# Altium project TIDA-01485.PrjPcb (part 1 of 2)
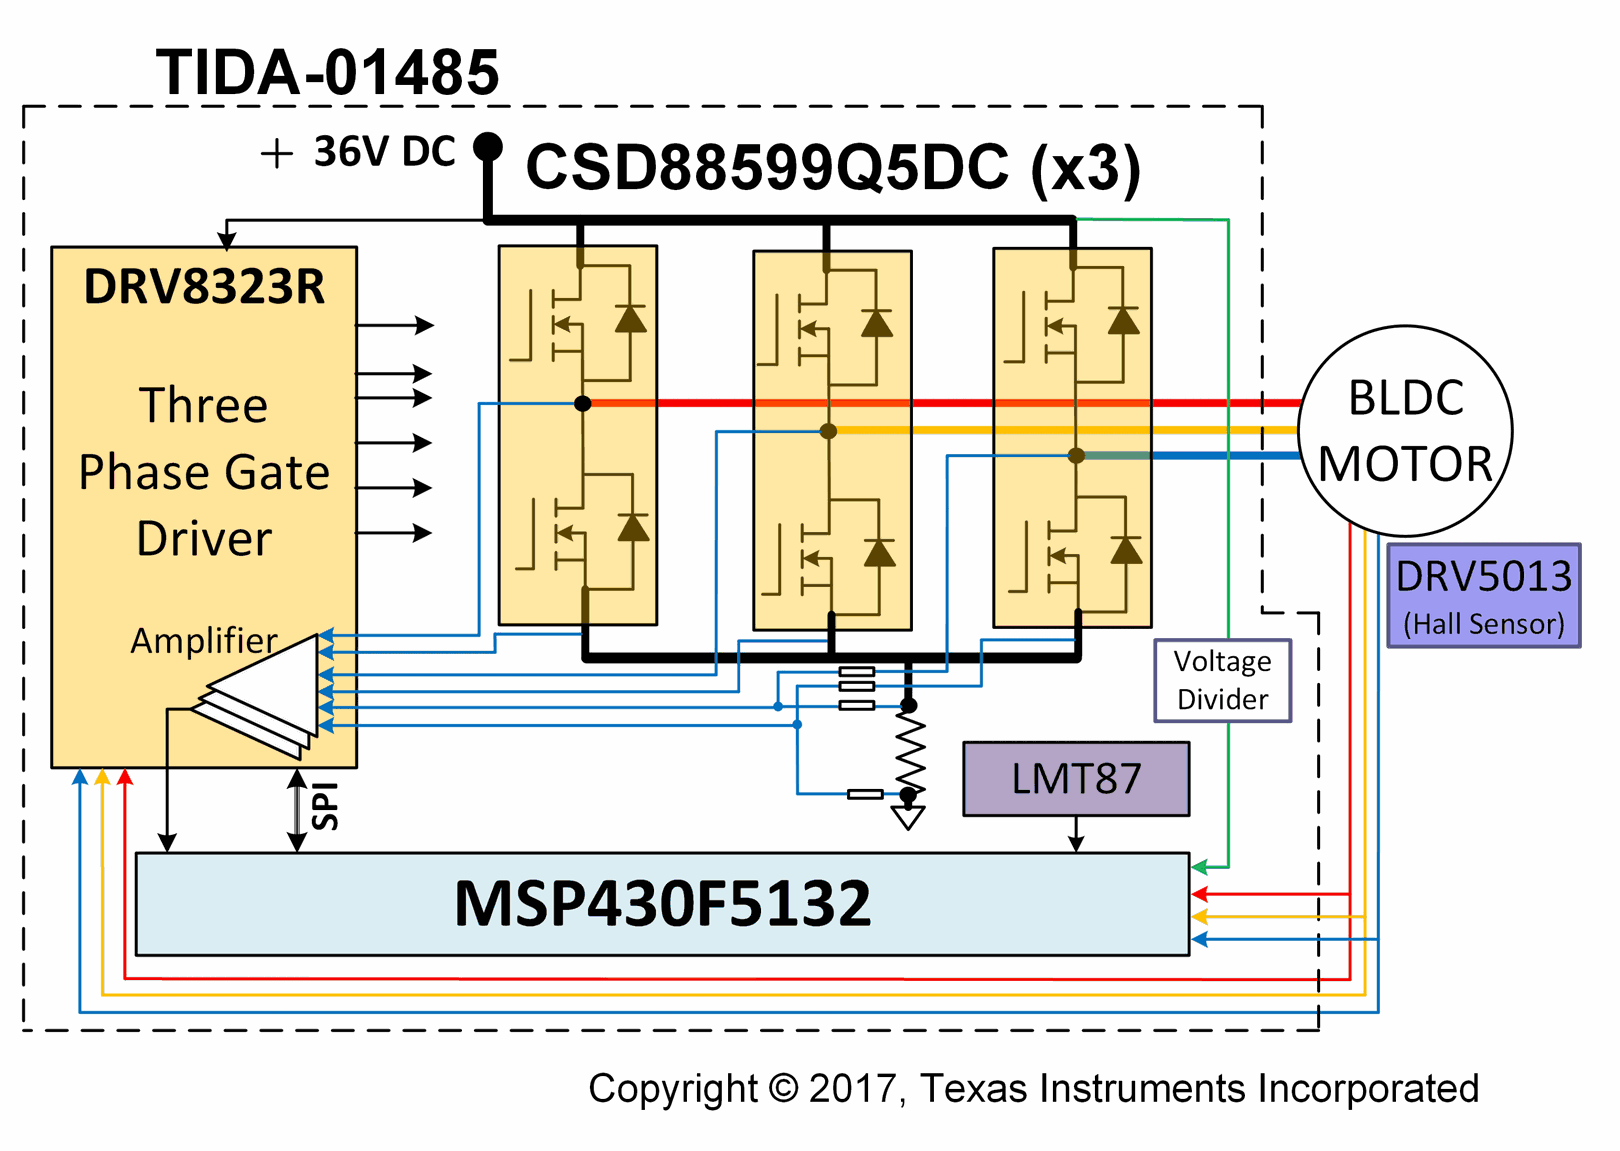
[diagram p0: TIDA-01485_CoverSheet.SchDoc]
CopyrightYear: 2017; EVM_orderable: N/A; PCB_Layout: Avinash N; PCB_Rev: E2; PRJ_Customer: Public Release; PRJ_Engineer: Manu Balakrishnan; PRJ_Number: TIDA-01485; PRJ_Title: 18V/1kW,  power stage for brushless motor; SCH_Rev: E2; TechSupport: http://www.ti.com/support; TID: 01485
5 sheets, 111 parts. Net scope: flat (ports and power ports of the same name join across sheets).
Board file: TIDA-01485.PcbDoc
Sheets:
  TIDA-01485_CoverSheet.SchDoc
  TIDA-01485_Page1.SchDoc
  TIDA-01485_Page2.SchDoc
  TIDA-01485_Page3.SchDoc
  TIDA-01485_Hardware.SchDoc

## Sheet TIDA-01485_CoverSheet.SchDoc
size 431 x 279 mm; Date: Not shown in title block; ApprovedBy: Not shown in title block; CheckedBy: Not shown in title block; Author: Not shown in title block; CompanyName: Not shown in title block; DrawnBy: Manu; Engineer: Not shown in title block; Organization: Not shown in title block; Address1: Not shown in title block; Address2: Not shown in title block; Address3: Not shown in title block; Address4: Not shown in title block; DocumentNumber: 1; Revision: Use project parameter SCH_Rev; SheetNumber: 1; SheetTotal: 5; PageSetup: Record=PageOptions|CenterHorizontal=True|CenterVertical=True|PrintScale=1.00|XCorrection=1.00|YCorrection=1.00|PrintKind=0|BorderSize=5000000|LeftOffset=0|BottomOffset=0|Orientation=2|PaperLength=1000|PaperWidth=1000|Scale=100|PaperSource=15|PrintQuality=600|MediaType=1|DitherType=10|PaperKind=Letter|PrintScaleMode=1; CurrentTime: Not shown in title block; CurrentDate: Not shown in title block; Time: Not shown in title block; DocumentFullPathAndName: Not shown in title block; DocumentName: Not shown in title block; ModifiedDate: Not shown in title block; ImagePath: Not shown in title block

### Notes on the sheet
- Drawn By:
- SVN Rev:
- Number:
- TID #:
- Orderable:
- Rev:
- Sheet Title:
- File:
- Project Title:
- Designed for:
- Assembly Variant:
- Mod. Date:
- Sheet:
- Size:
- of
- B
- http://www.ti.com
- Texas Instruments and/or its licensors do not warrant the accuracy or completeness of this specification or any information contained therein. Texas Instruments and/or its licensors do not warrant that this design will meet the specifications, will be suitable for your application or fit for any particular purpose, or will operate in an implementation. Texas Instruments and/or its licensors do not warrant that the design is production worthy. You should completely validate and test your design implementation to confirm the system functionality for your application.
- Engineer:
- Contact:
- © Texas Instruments

## Sheet TIDA-01485_Page1.SchDoc
size 431 x 279 mm; Date: Not shown in title block; ApprovedBy: Not shown in title block; CheckedBy: Not shown in title block; Author: Not shown in title block; CompanyName: Not shown in title block; DrawnBy: Manu; Engineer: Not shown in title block; Organization: Not shown in title block; Address1: Not shown in title block; Address2: Not shown in title block; Address3: Not shown in title block; Address4: Not shown in title block; DocumentNumber: 1; Revision: Use project parameter SCH_Rev; SheetNumber: 2; SheetTotal: 5; PageSetup: Record=PageOptions|CenterHorizontal=True|CenterVertical=True|PrintScale=1.00|XCorrection=1.00|YCorrection=1.00|PrintKind=0|BorderSize=5000000|LeftOffset=0|BottomOffset=0|Orientation=2|PaperLength=1000|PaperWidth=1000|Scale=100|PaperSource=15|PrintQuality=600|MediaType=1|DitherType=10|PaperKind=Letter|PrintScaleMode=1; CurrentTime: Not shown in title block; CurrentDate: Not shown in title block; Time: Not shown in title block; DocumentFullPathAndName: Not shown in title block; DocumentName: Not shown in title block; ModifiedDate: Not shown in title block; ImagePath: Not shown in title block
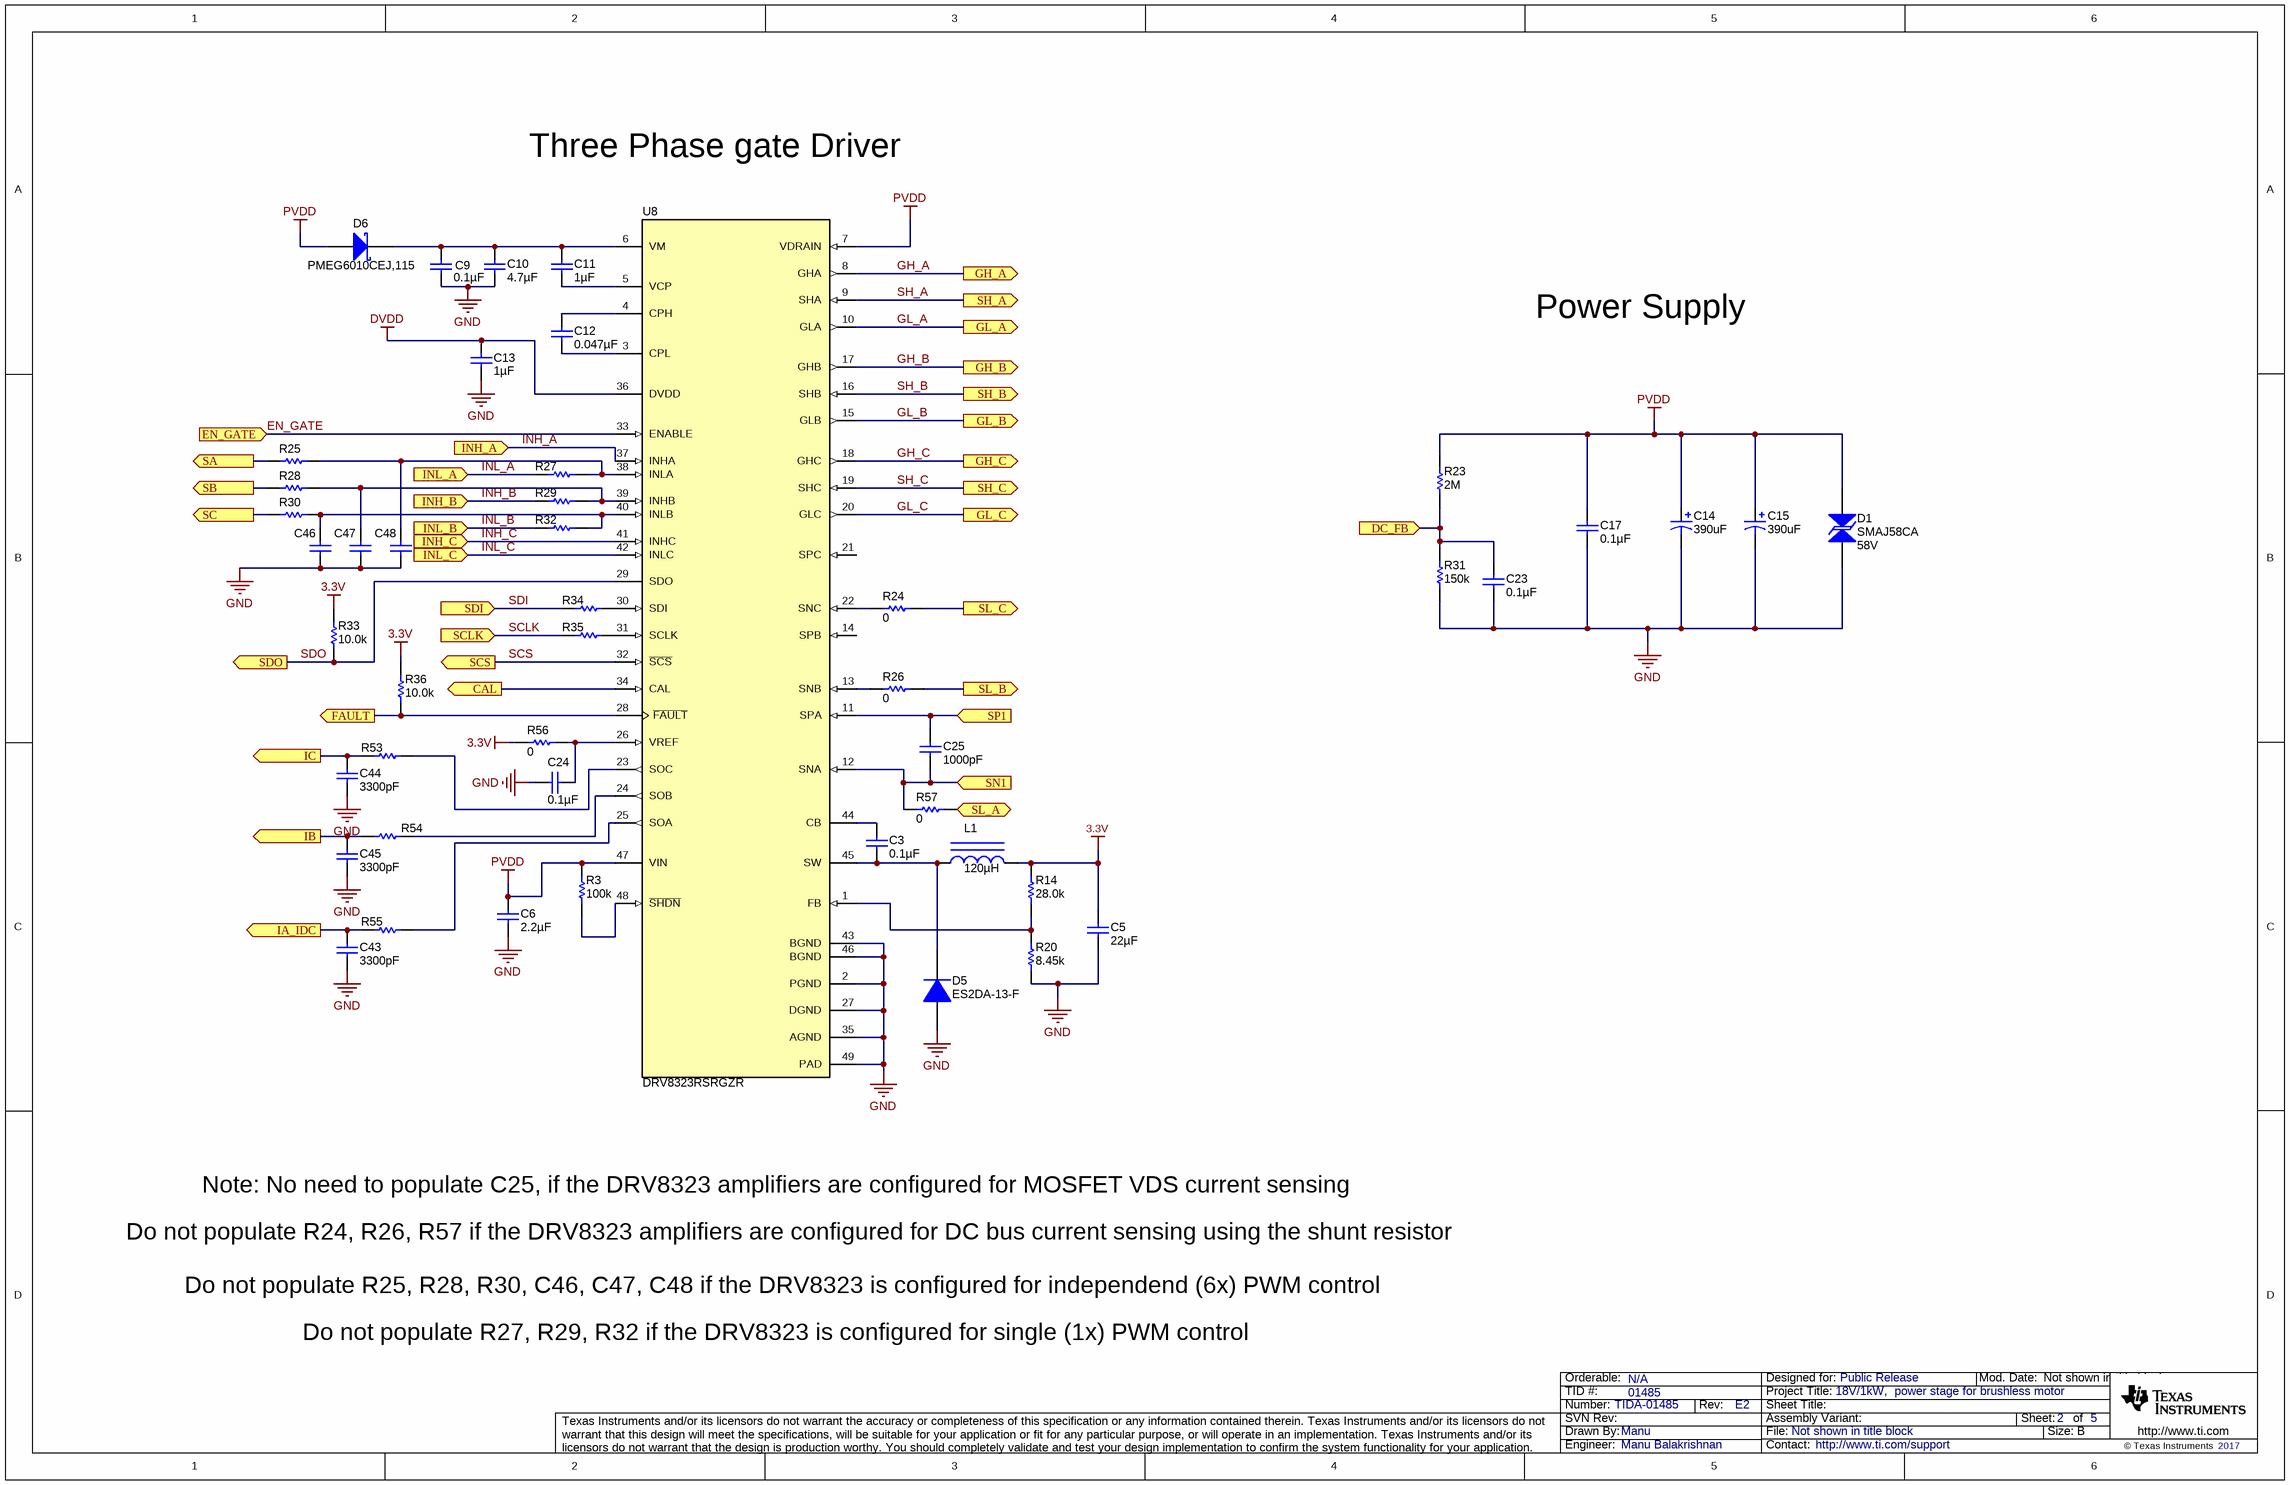
[diagram p1: TIDA-01485_Page1.SchDoc]

### Parts
C3  ValueDisplayed: 0.1µF  [0402]  (hidden comment: GRM155R71E103KA01D)
C5  ValueDisplayed: 22µF  [1210_280]  (hidden comment: C3225X7R1C226K250AC)
C6  ValueDisplayed: 2.2µF  [1210]  (hidden comment: GRM32ER72A225KA35L)
C9  ValueDisplayed: 0.1µF  [0603]  (hidden comment: 06035C104KAT2A)
C10  ValueDisplayed: 4.7µF  [0805_HV]  (hidden comment: GRM21BC71H475KE11K)
C11  ValueDisplayed: 1µF  [0603]  (hidden comment: C1608X7R1C105K)
C12  ValueDisplayed: 0.047µF  [0603]  (hidden comment: C1608X7S2A473K080AB)
C13  ValueDisplayed: 1µF  [0603]  (hidden comment: C1608X7R1C105K)
C14  ValueDisplayed: 390uF  [CAPPR5-10X20]  (hidden comment: 35ZLG470MEFC10X20)
C15  ValueDisplayed: 390uF  [CAPPR5-10X20]  (hidden comment: 35ZLG470MEFC10X20)
C17  ValueDisplayed: 0.1µF  [1206_180]  (hidden comment: C3216X7R2A104K160AA)
C23  ValueDisplayed: 0.1µF  [0402]  (hidden comment: 885012105016)
C24  ValueDisplayed: 0.1µF  [0402]  (hidden comment: 885012105016)
C25  ValueDisplayed: 1000pF  [0402]  (hidden comment: 885012205061)
C43  ValueDisplayed: 3300pF  [0402]  (hidden comment: CGA2B2X7R1H332K050BA)
C44  ValueDisplayed: 3300pF  [0402]  (hidden comment: CGA2B2X7R1H332K050BA)
C45  ValueDisplayed: 3300pF  [0402]  (hidden comment: CGA2B2X7R1H332K050BA)
C46  885012205061  [0402]  (value not drawn)
C47  885012205061  [0402]  (value not drawn)
C48  885012205061  [0402]  (value not drawn)
D1  SMAJ58CA  value 58V  [SMA]
D5  ES2DA-13-F  [SMA]
D6  PMEG6010CEJ,115  [SOD-323F]
L1  ValueDisplayed: 120µH  [SDR0302]  (hidden comment: SDR0302-121KL)
R3  ValueDisplayed: 100k  [0402]  (hidden comment: ERJ-2GEJ104X)
R14  ValueDisplayed: 28.0k  [0402]  (hidden comment: CRCW040230K9FKED)
R20  ValueDisplayed: 8.45k  [0402]  (hidden comment: CRCW040210K0FKED)
R23  ValueDisplayed: 2M  [0603]  (hidden comment: RC0603FR-0734K8L)
R24  ValueDisplayed: 0  [0402]  (hidden comment: RC0402JR-070RL)
R25  ERJ-2RKF1000X  [0402]  (value not drawn)
R26  ValueDisplayed: 0  [0402]  (hidden comment: RC0402JR-070RL)
R27  ERJ-2RKF1000X  [0402]  (value not drawn)
R28  ERJ-2RKF1000X  [0402]  (value not drawn)
R29  ERJ-2RKF1000X  [0402]  (value not drawn)
R30  ERJ-2RKF1000X  [0402]  (value not drawn)
R31  ValueDisplayed: 150k  [0402]  (hidden comment: ERJ-2RKF2201X)
R32  ERJ-2RKF1000X  [0402]  (value not drawn)
R33  ValueDisplayed: 10.0k  [0402]  (hidden comment: CRCW040210K0FKED)
R34  ERJ-2RKF1000X  [0402]  (value not drawn)
R35  ERJ-2RKF1000X  [0402]  (value not drawn)
R36  ValueDisplayed: 10.0k  [0402]  (hidden comment: CRCW040210K0FKED)
R53  ERJ-2RKF1000X  [0402]  (value not drawn)
R54  ERJ-2RKF1000X  [0402]  (value not drawn)
R55  ERJ-2RKF1000X  [0402]  (value not drawn)
R56  ValueDisplayed: 0  [0402]  (hidden comment: RC0402JR-070RL)
R57  ValueDisplayed: 0  [0402]  (hidden comment: RC0402JR-070RL)
U8  DRV8323RSRGZR  [RGZ0048B]

### Ports
CAL (out), DC_FB (in), EN_GATE (in), FAULT (out), GH_A (out), GH_B (out), GH_C (out), GL_A (out), GL_B (out), GL_C (out), IA_IDC (out), IB (out), IC (out), INH_A (in), INH_B (in), INH_C (in), INL_A (in), INL_B (in), INL_C (in), SA (out), SB (out), SC (out), SCLK (in), SCS (out), SDI (in), SDO (out), SH_A (out), SH_B (out), SH_C (out), SL_A (out), SL_B (out), SL_C (out), SN1 (in), SP1 (in)

### Nets
3.3V: C5.1 L1.2 R14.2 R33.1 R36.1 R56.1
DVDD: C13.1 U8.36(DVDD)
GND: C5.2 C6.2 C9.2 C10.1 C13.2 C14.2(-) C15.2(-) C17.2 C23.2 C24.2 C43.2 C44.2 C45.2 C46.2 C47.2 C48.2 D1.1 D5.2(A) R20.1 R31.1 U8.2(PGND) U8.27(DGND) U8.35(AGND) U8.43(BGND) U8.46(BGND) U8.49(PAD)
PVDD: C6.1 C14.1(+) C15.1(+) C17.1 D1.2 D6.2(A) R3.2 R23.2 U8.7(VDRAIN) U8.47(VIN)
CAL: U8.34(CAL) ; port CAL
DC_FB: C23.1 R23.1 R31.2 ; port DC_FB
EN_GATE: U8.33(ENABLE) ; port EN_GATE
FAULT: R36.2 U8.28(~{FAULT}) ; port FAULT
GH_A: U8.8(GHA) ; port GH_A
GH_B: U8.17(GHB) ; port GH_B
GH_C: U8.18(GHC) ; port GH_C
GL_A: U8.10(GLA) ; port GL_A
GL_B: U8.15(GLB) ; port GL_B
GL_C: U8.20(GLC) ; port GL_C
IA_IDC: C43.1 R55.2 ; port IA_IDC
IB: C45.1 R54.2 ; port IB
IC: C44.1 R53.2 ; port IC
INH_A: U8.37(INHA) ; port INH_A
INH_B: R29.1 ; port INH_B
INH_C: U8.41(INHC) ; port INH_C
INL_A: R27.1 ; port INL_A
INL_B: R32.1 ; port INL_B
INL_C: U8.42(INLC) ; port INL_C
SA: R25.1 ; port SA
SB: R28.1 ; port SB
SC: R30.1 ; port SC
SCLK: R35.2 ; port SCLK
SCS: U8.32(~{SCS}) ; port SCS
SDI: R34.2 ; port SDI
SDO: R33.2 U8.29(SDO) ; port SDO
SH_A: U8.9(SHA) ; port SH_A
SH_B: U8.16(SHB) ; port SH_B
SH_C: U8.19(SHC) ; port SH_C
SL_A: R24.1 R26.1 R57.1 ; port SL_B, port SL_C, port SL_A
SN1: C25.2 R57.2 U8.12(SNA) ; port SN1
SP1: C25.1 U8.11(SPA) ; port SP1
NetC3_1: C3.1 U8.44(CB)
NetC3_2: C3.2 D5.1(K) L1.1 U8.45(SW)
NetC9_1: C9.1 C10.2 C11.1 D6.1(K) U8.6(VM)
NetC11_2: C11.2 U8.5(VCP)
NetC12_1: C12.1 U8.3(CPL)
NetC12_2: C12.2 U8.4(CPH)
NetC24_1: C24.1 R56.2 U8.26(VREF)
NetC46_1: C46.1 R30.2 R32.2 U8.40(INLB)
NetC47_1: C47.1 R28.2 R29.2 U8.39(INHB)
NetC48_1: C48.1 R25.2 R27.2 U8.38(INLA)
NetR3_1: R3.1 U8.48(~{SHDN})
NetR14_1: R14.1 R20.2 U8.1(FB)
NetR24_2: R24.2 U8.22(SNC)
NetR26_2: R26.2 U8.13(SNB)
NetR34_1: R34.1 U8.30(SDI)
NetR35_1: R35.1 U8.31(SCLK)
NetR53_1: R53.1 U8.23(SOC)
NetR54_1: R54.1 U8.24(SOB)
NetR55_1: R55.1 U8.25(SOA)

Not connected (* = marked no-connect by the designer): U8 14(SPB) 21(SPC)

### Notes on the sheet
- Three Phase gate Driver
- Power Supply
- Note: No need to populate C25, if the DRV8323 amplifiers are configured for MOSFET VDS current sensing
- Do not populate R24, R26, R57 if the DRV8323 amplifiers are configured for DC bus current sensing using the shunt resistor
- Do not populate R25, R28, R30, C46, C47, C48 if the DRV8323 is configured for independend (6x) PWM control
- Do not populate R27, R29, R32 if the DRV8323 is configured for single (1x) PWM control
- Drawn By:
- SVN Rev:
- Number:
- TID #:
- Orderable:
- Rev:
- Sheet Title:
- File:
- Project Title:
- Designed for:
- Assembly Variant:
- Mod. Date:
- Sheet:
- Size:
- of
- B
- http://www.ti.com
- Texas Instruments and/or its licensors do not warrant the accuracy or completeness of this specification or any information contained therein. Texas Instruments and/or its licensors do not warrant that this design will meet the specifications, will be suitable for your application or fit for any particular purpose, or will operate in an implementation. Texas Instruments and/or its licensors do not warrant that the design is production worthy. You should completely validate and test your design implementation to confirm the system functionality for your application.
- Engineer:
- Contact:
- © Texas Instruments

### Library data of the parts
C3 C24 = 885012105016: CAP, CERM, 0.1 µF, 16 V, +/- 20%, X5R, 0402; Manufacturer: Wurth Elektronik; Polarized: N; CompType: Capacitor; Value: 0.1uF; U/M: EA; Cap_F: 0.0000001; Tolerance_%: 20; Value1: Unknown; VDC_V: 16; Value2: 16V; TaMin_C: -55; TaMax_C: 85; SizeArea_mm2: 0.5; SizeAreaWB_mm2: 3; SizeX_mm: 1; SizeZ_mm: 0.6; AEC Category: Q200; SymbolVersion: 2008-07-09; PartNumber: 885012105016; PackageReference: 0402; RoHS: Y; MountType: SMT; Technology: Ceramic; TempCo: X5R; Cap_Case: 0402; SizeY_mm: 0.5; Published: 2008-06-19; Publisher: Texas Instruments; LatestRevisionDate: 2016-08-24; ComponentLink1Description: Datasheet link; ComponentLink1URL: http://katalog.we-online.de/pbs/datasheet/885012105016.pdf; Supplier 1: Mouser; Supplier Part Number 1: 710-885012105016; Supplier 2: Newark; Supplier Part Number 2: 40Y4445; AEC Qualified: N; AEC Grade: N/A
C5 = C3225X7R1C226K250AC: CAP, CERM, 22 µF, 16 V,+/- 10%, X7R, 1210; Manufacturer: TDK; Polarized: N; CompType: Capacitor; Value: 22uF; U/M: EA; Cap_F: 0.000022; Tolerance_%: 10; ESR_ohm: 0.002582; Value1: 0.002582 ohm; VDC_V: 16; Value2: 16V; IRMS_A: 4.57562; TaMin_C: -55; TaMax_C: 125; Cap_Case: 1210; SizeArea_mm2: 8; SizeAreaWB_mm2: 14.7; SizeX_mm: 3.2; SizeY_mm: 2.5; SizeZ_mm: 2.8; AEC Category: Q200; Green_Lifecycle: Active; Green_REACh: Passed; SymbolVersion: 2008-07-09; PartNumber: C3225X7R1C226K250AC; PackageReference: 1210; RoHS: Y; MountType: SMT; Technology: Ceramic; TempCo: X7R; Published: 2008-06-19; Publisher: Texas Instruments; LatestRevisionDate: 2017-06-12; ComponentLink1Description: Datasheet link; ComponentLink1URL: https://product.tdk.com/en/search/capacitor/ceramic/mlcc/info?part_no=C3225X7R1C226K250AC; Supplier 1: Digi-Key; Supplier Part Number 1: 445-3945-1-ND; Supplier 2: Newark; Supplier Part Number 2: 90R7828; Supplier 3: Mouser; Supplier Part Number 3: 810-C3225X7R1C226K; AEC Qualified: N; AEC Grade: N/A; Green_EU RoHS: Passed; Green_EU RoHS-2: Passed
C6 = GRM32ER72A225KA35L: CAP, CERM, 2.2uF, 100V, +/-10%, X7R, 1210; Manufacturer: MuRata; Polarized: N; CompType: Capacitor; U/M: EA; Cap_F: 0.0000022; Tolerance_%: 10; ESR_Ohm: 0.007; Value1: 0.007 ohm; VDC_V: 100; IRMS_A: 4.4; TaMin_C: -55; TaMax_C: 125; SymbolVersion: 2008-07-09; Value: 2.2uF; PartNumber: GRM32ER72A225KA35L; PackageReference: 1210; RoHS: Y; Value2: 100V; MountType: SMT; Technology: Ceramic; TempCo: X7R; Cap_Case: 1210; Published: 2008-06-19; Publisher: Texas Instruments; LatestRevisionDate: 2014-07-08; ComponentLink1Description: Datasheet link; ComponentLink1URL: http://search.murata.co.jp/Ceramy/PnsearchViewAction.do?HnOFG=ON&HnNFG=ON&SEL_CNT=50&sLang=en&sKey=GRM32ER72A225KA35L&x=9&y=9&search=startwith; Supplier 1: Digi-Key; Supplier Part Number 1: 490-3385-1-ND; Supplier 2: Mouser; Supplier Part Number 2: 81-GRM32ER72A225KA35; Supplier 3: Farnell; Supplier Part Number 3: 1735547
C9 = 06035C104KAT2A: CAP, CERM, 0.1 µF, 50 V, +/- 10%, X7R, 0603; Manufacturer: AVX; Polarized: N; CompType: Capacitor; Value: 0.1uF; U/M: EA; Cap_F: 0.0000001; Tolerance_%: 10; Value1: Unknown; VDC_V: 50; Value2: 50V; TaMin_C: -55; TaMax_C: 125; SymbolVersion: 2008-07-09; PartNumber: 06035C104KAT2A; PackageReference: 0603; RoHS: Y; MountType: SMT; Technology: Ceramic; TempCo: X7R; Cap_Case: 0603; Published: 2008-06-19; Publisher: Texas Instruments; LatestRevisionDate: 2015-02-27; ComponentLink1Description: Datasheet link; ComponentLink1URL: http://www.avx.com/docs/Catalogs/cx7r.pdf; Supplier 1: Digi-Key; Supplier Part Number 1: 478-5052-1-ND; Supplier 2: Mouser; Supplier Part Number 2: 581-06035C104KAT2A; Supplier 3: Farnell; Supplier Part Number 3: 1301804
C10 = GRM21BC71H475KE11K: CAP, CERM, 4.7 µF, 50 V,+/- 10%, X7S, 0805; Manufacturer: MuRata; Polarized: N; CompType: Capacitor; Value: 4.7uF; U/M: EA; Cap_F: 0.0000047; Tolerance_%: 10; Value1: Unknown; VDC_V: 50; Value2: 50V; TaMin_C: -55; TaMax_C: 125; Cap_Case: 0805; SizeArea_mm2: 2.5; SizeAreaWB_mm2: 6.75; SizeX_mm: 2; SizeY_mm: 1.25; SizeZ_mm: 1.45; AEC Category: Q200; SymbolVersion: 2008-07-09; PartNumber: GRM21BC71H475KE11K; PackageReference: 0805; RoHS: Y; MountType: SMT; Technology: Ceramic; TempCo: X7S; Published: 2008-06-19; Publisher: Texas Instruments; LatestRevisionDate: 2017-06-12; ComponentLink1Description: Datasheet link; ComponentLink1URL: http://www.murata.com/~/media/webrenewal/support/library/catalog/products/capacitor/mlcc/c02e.ashx; Supplier 1: Digi-Key; Supplier Part Number 1: GRM21BC71H475KE11K-ND; Supplier 2: Mouser; Supplier Part Number 2: 81-GRM21BC71H475KE1K; AEC Qualified: N; AEC Grade: N/A
C11 C13 = C1608X7R1C105K: CAP, CERM, 1 µF, 16 V, +/- 10%, X7R, 0603; Manufacturer: TDK; Polarized: N; CompType: Capacitor; Value: 1uF; U/M: EA; Cap_F: 0.000001; Tolerance_%: 10; ESR_ohm: 0.0057; Value1: 0.0057 ohm; VDC_V: 16; Value2: 16V; TaMin_C: -55; TaMax_C: 125; AEC Category: Q200; SymbolVersion: 2008-07-09; PartNumber: C1608X7R1C105K; PackageReference: 0603; RoHS: Y; MountType: SMT; Technology: Ceramic; TempCo: X7R; Cap_Case: 0603; Published: 2008-06-19; Publisher: Texas Instruments; LatestRevisionDate: 2016-01-08; ComponentLink1Description: Datasheet link; ComponentLink1URL: http://www.tdk.co.jp/tefe02/e412_c.pdf; Supplier 1: Digi-Key; Supplier Part Number 1: 445-1604-1-ND; Supplier 2: Farnell; Supplier Part Number 2: 1907343; AEC Qualified: ?
C12 = C1608X7S2A473K080AB: CAP, CERM, 0.047 µF, 100 V,+/- 10%, X7S, 0603; Manufacturer: TDK; Polarized: N; CompType: Capacitor; Value: 0.047uF; U/M: EA; Cap_F: 0.000000047; Tolerance_%: 10; ESR_ohm: 0.089796; Value1: 0.089796 ohm; VDC_V: 100; Value2: 100V; IRMS_A: 0.567484; TaMin_C: -55; TaMax_C: 125; SizeArea_mm2: 1.28; SizeAreaWB_mm2: 4.68; SizeX_mm: 1.6; SizeY_mm: 0.8; SizeZ_mm: 1; AEC Category: Q200; SymbolVersion: 2008-07-09; PartNumber: C1608X7S2A473K080AB; PackageReference: 0603; RoHS: Y; MountType: SMT; Technology: Ceramic; TempCo: X7S; Cap_Case: 0603; Published: 2008-06-19; Publisher: Texas Instruments; LatestRevisionDate: 2017-06-12; ComponentLink1Description: Datasheet link; ComponentLink1URL: https://product.tdk.com/en/search/capacitor/ceramic/mlcc/info?part_no=C1608X7S2A473K080AB; Supplier 1: Digi-Key; Supplier Part Number 1: 445-6032-1-ND; Supplier 2: Mouser; Supplier Part Number 2: 810-C1608X7S2A473K080AB; AEC Qualified: N; AEC Grade: N/A
C14 C15 = 35ZL470MEFC10X20: CAP ALUM 390UF 20% 50V RADIAL; PartNumber: UHW1H391MPD6; Manufacturer: Nichicon; Polarized: Y; CompType: Capacitor; U/M: EA; Cap_F: 0.000390; Tolerance_%: 20; Value1: Unknown; VDC_V: 50; TaMin_C: -40; TaMax_C: 105; Cap_Case: 10x22; AEC Category: Q200; AEC Qualified: N; SymbolVersion: 2008-07-09; Value: 390uF; PackageReference: 10x22; RoHS: Y; Value2: 50V; MountType: TH; Technology: AL; Series: ZL; Publisher: Texas Instruments; LatestRevisionDate: 2015-12-17; ComponentLink1Description: Datasheet link; ComponentLink1URL: http://nichicon-us.com/english/products/pdfs/e-uhw.pdf; Supplier 1: Digi-Key; Supplier Part Number 1: 493-6885-ND; AEC Grade: N/A
C17 = C3216X7R2A104K160AA: CAP, CERM, 0.1 µF, 100 V, +/- 10%, X7R, 1206; Manufacturer: TDK; Polarized: N; CompType: Capacitor; Value: 0.1uF; U/M: EA; Cap_F: 0.0000001; Tolerance_%: 10; ESR_ohm: 0.030343; Value1: 0.030343 ohm; VDC_V: 100; Value2: 100V; IRMS_A: 1.33802; TaMin_C: -55; TaMax_C: 125; Cap_Case: 1206; AEC Category: Q200; SizeArea_mm2: 5.12; SizeAreaWB_mm2: 10.92; SizeX_mm: 3.2; SizeY_mm: 1.6; SizeZ_mm: 1.8; Green_Lifecycle: Active; Green_REACh: Passed; SymbolVersion: 2008-07-09; PartNumber: C3216X7R2A104K160AA; PackageReference: 1206; RoHS: Y; MountType: SMT; Technology: Ceramic; TempCo: X7R; Published: 2008-06-19; Publisher: Texas Instruments; LatestRevisionDate: 2017-05-19; ComponentLink1Description: Datasheet link; ComponentLink1URL: https://product.tdk.com/en/search/capacitor/ceramic/mlcc/info?part_no=C3216X7R2A104K160AA; Supplier 1: Digi-Key; Supplier Part Number 1: 445-1377-1-ND; Supplier 2: Mouser; Supplier Part Number 2: 810-C3216X7R2A104K160AA; AEC Qualified: N; AEC Grade: N/A; Green_EU RoHS: Passed; Green_EU RoHS-2: Passed
C23 = 885012105016: CAP, CERM, 0.1 µF, 16 V, +/- 20%, X5R, 0402; Manufacturer: Wurth Elektronik; Polarized: N; CompType: Capacitor; Value: 0.1uF; U/M: EA; Cap_F: 0.0000001; Tolerance_%: 20; Value1: Unknown; VDC_V: 16; Value2: 16V; TaMin_C: -55; TaMax_C: 85; AEC Category: Q200; SymbolVersion: 2008-07-09; PartNumber: 885012105016; PackageReference: 0402; RoHS: Y; MountType: SMT; Technology: Ceramic; TempCo: X5R; Cap_Case: 0402; Published: 2008-06-19; Publisher: Texas Instruments; LatestRevisionDate: 2016-01-15; ComponentLink1Description: Datasheet link; ComponentLink1URL: http://katalog.we-online.de/pbs/datasheet/885012105016.pdf; Supplier 1: Mouser; Supplier Part Number 1: 710-885012105016; Supplier 2: Newark; Supplier Part Number 2: 40Y4445; AEC Qualified: N; AEC Grade: N/A
C25 C46-C48 = 885012205061: CAP, CERM, 1000 pF, 50 V, +/- 10%, X7R, 0402; Manufacturer: Wurth Elektronik; Polarized: N; CompType: Capacitor; Value: 1000pF; U/M: EA; Cap_F: 0.000000001; Tolerance_%: 10; Value1: Unknown; VDC_V: 50; Value2: 50V; TaMin_C: -55; TaMax_C: 125; AEC Category: Q200; SymbolVersion: 2008-07-09; PartNumber: 885012205061; PackageReference: 0402; RoHS: Y; MountType: SMT; Technology: Ceramic; TempCo: X7R; Cap_Case: 0402; Published: 2008-06-19; Publisher: Texas Instruments; LatestRevisionDate: 2016-01-08; ComponentLink1Description: Datasheet link; ComponentLink1URL: http://katalog.we-online.de/pbs/datasheet/885012205061.pdf; Supplier 1: Digi-Key; Supplier Part Number 1: 732-7556-1-ND; Supplier 2: Mouser; Supplier Part Number 2: 710-885012205061; AEC Qualified: N; AEC Grade: N/A
  C46-C48: ValueDisplayed: 1000pF
C43-C45 = CGA2B2X7R1H332K050BA: CAP, CERM, 3300 pF, 50 V, +/- 10%, X7R, AEC-Q200 Grade 1, 0402; Manufacturer: TDK; Polarized: N; CompType: Capacitor; Value: 3300pF; U/M: EA; Cap_F: 0.0000000033; Tolerance_%: 10; ESR_ohm: 0.785178; Value1: 0.785178 ohm; VDC_V: 50; Value2: 50V; IRMS_A: 0.272902; TaMin_C: -55; TaMax_C: 125; SizeArea_mm2: 0.5; SizeAreaWB_mm2: 3; SizeX_mm: 1; SizeZ_mm: 0.6; AEC Category: Q200; AEC Qualified: Y; SymbolVersion: 2008-07-09; PartNumber: CGA2B2X7R1H332K050BA; PackageReference: 0402; RoHS: Y; MountType: SMT; Technology: Ceramic; TempCo: X7R; Cap_Case: 0402; SizeY_mm: 0.5; Published: 2008-06-19; Publisher: Texas Instruments; LatestRevisionDate: 2016-08-24; ComponentLink1Description: Datasheet link; ComponentLink1URL: https://product.tdk.com/en/search/capacitor/ceramic/mlcc/info?part_no=CGA2B2X7R1H332K050BA; Supplier 1: Digi-Key; Supplier Part Number 1: 445-6891-1-ND; Supplier 2: Mouser; Supplier Part Number 2: 810-CGA2B2X7R1H332K050BA; AEC Grade: 1
D1 = SMAJ58CA: Diode, TVS, Bi, 58 V, SMA; Manufacturer: Littelfuse; U/M: EA; Power_W: 3.3; Vr_V: 58; Value1: 3.3W; RJA_CperW: 120; SizeAreaWB_mm2: 37.3428; SizeArea_mm2: 16.3228; SizeX_mm: 5.59; SizeY_mm: 2.92; SizeZ_mm: 2.87; AEC Category: Q101; CompType: TVS; SymbolVersion: 2012-01-13; PartNumber: SMAJ58CA; PackageReference: SMA; Vz_V: N/A; MountType: SMT; RoHS: Y; ComponentLink1Description: Datasheet link; ComponentLink1URL: http://www.littelfuse.com/~/media/electronics/datasheets/tvs_diodes/littelfuse_tvs_diode_smaj_datasheet.pdf.pdf; Published: 2008-10-08; Publisher: Texas Instruments; LatestRevisionDate: 2016-08-19; LatestRevisionNote: Updated Supplier Data; Supplier 1: Digi-Key; Supplier Part Number 1: SMAJ58CALFDKR-ND; Supplier 2: Mouser; Supplier Part Number 2: 576-SMAJ58CA; Supplier 3: Farnell; Supplier Part Number 3: 1685149; AEC Qualified: ?
D5 = ES2DA-13-F: Diode, Superfast Rectifier, 200 V, 2 A, SMA; Manufacturer: Diodes Inc.; U/M: EA; Vf_V: 0.92; Value: 200V; Value1: 2A; Value2: 0.92V; Io_A: 2; Vr_V: 200; TJmax_C: 150; RJC_CperW: 20; SizeAreaWB_mm2: 37.3428; SizeArea_mm2: 16.3228; SizeX_mm: 5.59; SizeY_mm: 2.92; SizeZ_mm: 2.87; AEC Category: Q101; SymbolVersion: 2008-12-08; PartNumber: ES2DA-13-F; PackageReference: SMA; CompType: Diode; MountType: SMT; Type: Superfast Rectifier; RoHS: Y; Published: 2008-06-26; Publisher: Texas Instruments; LatestRevisionDate: 2016-08-24; ComponentLink1Description: Datasheet link; ComponentLink1URL: http://www.diodes.com/datasheets/ds14002.pdf; Supplier 1: Digi-Key; Supplier Part Number 1: ES2DA-FDICT-ND; Supplier 2: Mouser; Supplier Part Number 2: 621-ES2DA-13-F; Supplier 3: Newark; Supplier Part Number 3: 65W8574; AEC Qualified: ?
D6 = PMEG6010CEJ,115: Diode, Schottky, 60 V, 1 A, SOD-323F; Manufacturer: NXP Semiconductor; U/M: EA; Vf_V: 0.66; Value: 60V; Value1: 1A; Value2: 0.66V; Io_A: 1; Vr_V: 60; TJmax_C: 150; SizeAreaWB_mm2: 7.875; SizeArea_mm2: 3.125; SizeX_mm: 2.5; SizeY_mm: 1.25; SizeZ_mm: 0.8; AEC Category: Q101; CompType: Diode; SymbolVersion: 2008-12-08; PartNumber: PMEG6010CEJ,115; PackageReference: SOD-323F; MountType: SMT; Type: Schottky; RoHS: Y; Published: 2008-06-26; Publisher: Texas Instruments; LatestRevisionDate: 2016-08-24; ComponentLink1Description: Datasheet link; ComponentLink1URL: http://www.nxp.com/documents/data_sheet/PMEG6010CEH_PMEG6010CEJ.pdf; Supplier 1: Digi-Key; Supplier Part Number 1: 568-4138-1-ND; Supplier 2: Mouser; Supplier Part Number 2: 771-PMEG6010CEJ-T/R; Supplier 3: Farnell; Supplier Part Number 3: 1867616; AEC Qualified: ?
L1 = SDR0302-121KL: Inductor, Drum Core, Ferrite, 120uH, 0.22A, 3.2 ohm, SMD; Manufacturer: Bourns; Ind_H: 120.0E-6; Imax_A: 0.22; Irms: 0.22A @ 40C rise; Isat: 0.29A @ 10% inductance drop; DCR_ohm: 3.2; Value1: 3.2 ohm; SymbolVersion: 2008-07-23; CompType: Inductor; Value: 120uH; PartNumber: SDR0302-121KL; Value2: 0.22A; Technology: Drum Core; MountType: SMT; Material: Ferrite; PackageReference: 3x2.5x2.8mm; Published: 2008-06-26; Publisher: Texas Instruments; LatestRevisionDate: 2014-06-23; ComponentLink1Description: Datasheet link; ComponentLink1URL: http://www.bourns.com/data/global/pdfs/SDR0302.pdf; RoHS: Y; Supplier 1: Digi-Key; Supplier Part Number 1: SDR0302-121KLCT-ND; Supplier 2: Mouser; Supplier Part Number 2: 652-SDR0302-121KL
R3 = ERJ-2GEJ104X: RES, 100 k, 5%, 0.1 W, AEC-Q200 Grade 0, 0402; Manufacturer: Panasonic; CompType: Resistor; Value: 100k; Res_ohm: 100000; Tolerance_%: 5; Power_W: 0.1; Value2: 0.1W; VDC_V: 50; TempCo: 200 ppm/C; SizeArea_mm2: 0.5; SizeX_mm: 1; SizeZ_mm: 0.6; EIA_Code: E24; U/M: EA; AEC Category: Q200; AEC Qualified: Y; AEC Grade: 0; Green_Lifecycle: Active; Green_REACh: Passed; SymbolVersion: 2009-05-29; PartNumber: ERJ-2GEJ104X; PackageReference: 0402; RoHS: Y; Value_Code: 100k; Value1: 5%; MountType: SMT; Technology: Thick Film; SizeY_mm: 0.5; Published: 2008-06-26; Publisher: Texas Instruments; LatestRevisionDate: 2017-06-12; ComponentLink1Description: Datasheet link; ComponentLink1URL: http://industrial.panasonic.com/cdbs/www-data/pdf/RDA0000/AOA0000CE1.pdf; Supplier 1: Digi-Key; Supplier Part Number 1: P100KJCT-ND; Supplier 2: Newark; Supplier Part Number 2: 65T8249; Supplier 3: Mouser; Supplier Part Number 3: 667-ERJ-2GEJ104X; Green_EU RoHS: Passed with Exemption; Green_EU RoHS-2: Passed
R14 = CRCW040228K0FKED: RES, 28.0 k, 1%, 0.063 W, 0402; Manufacturer: Vishay-Dale; CompType: Resistor; Value: 28.0k; Res_ohm: 28000; Value_Code: 28k0; Tolerance_%: 1; Power_W: 0.063; Value2: 0.063W; VDC_V: 50; TempCo: 100 ppm/C; SizeArea_mm2: 0.5; SizeZ_mm: 0.6; EIA_Code: E96; U/M: EA; AEC Category: Q200; SymbolVersion: 2009-05-29; PartNumber: CRCW040228K0FKED; PackageReference: 0402; RoHS: Y; Value1: 1%; MountType: SMT; Technology: Thick Film; SizeX_mm: 1; SizeY_mm: 0.5; Published: 2008-06-26; Publisher: Texas Instruments; LatestRevisionDate: 2016-08-08; ComponentLink1Description: Datasheet link; ComponentLink1URL: http://www.vishay.com/docs/20035/dcrcwe3.pdf; Supplier 1: Digi-Key; Supplier Part Number 1: 541-28.0KLCT-ND; Supplier 2: Mouser; Supplier Part Number 2: 71-CRCW0402-28K-E3; Supplier 3: Farnell; Supplier Part Number 3: 1151102; AEC Qualified: ?
R20 = CRCW04028K45FKED: RES, 8.45 k, 1%, 0.063 W, 0402; Manufacturer: Vishay-Dale; CompType: Resistor; Value: 8.45k; Res_ohm: 8450; Value_Code: 8k45; Tolerance_%: 1; Power_W: 0.063; Value2: 0.063W; VDC_V: 50; TempCo: 100 ppm/C; SizeArea_mm2: 0.5; SizeZ_mm: 0.6; EIA_Code: E96; U/M: EA; AEC Category: Q200; SymbolVersion: 2009-05-29; PartNumber: CRCW04028K45FKED; PackageReference: 0402; RoHS: Y; Value1: 1%; MountType: SMT; Technology: Thick Film; SizeX_mm: 1; SizeY_mm: 0.5; Published: 2008-06-26; Publisher: Texas Instruments; LatestRevisionDate: 2016-08-08; ComponentLink1Description: Datasheet link; ComponentLink1URL: http://www.vishay.com/docs/20035/dcrcwe3.pdf; Supplier 1: Digi-Key; Supplier Part Number 1: 541-8.45KLCT-ND; Supplier 2: Mouser; Supplier Part Number 2: 71-CRCW0402-8.45K-E3; Supplier 3: Farnell; Supplier Part Number 3: 1151511; AEC Qualified: ?
R23 = RC0603FR-0734K8L: RES SMD 2M OHM 1% 1/10W 0603; PartNumber: RC0603FR-072ML; Manufacturer: Yageo; CompType: Resistor; Res_ohm: 34800; Tolerance_%: 1; Power_W: 0.1; Value2: 0.1W; VDC_V: 150; TempCo: 200 ppm/C; EIA_Code: E96; U/M: EA; AEC Category: Q200; SymbolVersion: 2009-05-29; Value: 2M; PackageReference: 0603; RoHS: Y; Value_Code: 2M; Value1: 1%; MountType: SMT; Technology: Thick Film; Published: 2008-06-26; Publisher: Texas Instruments; LatestRevisionDate: 2015-12-05; ComponentLink1Description: Datasheet link; ComponentLink1URL: http://www.yageo.com.tw/exep/pages/download/literatures/PYu-R_INT-thick_7.pdf; Supplier 1: Digi-Key; Supplier Part Number 1: 311-2.00MHRCT-ND; Supplier 2: Mouser; Supplier Part Number 2: 603-RC0603FR-0734K8L; AEC Qualified: ?
R24 R26 R56 R57 = RC0402JR-070RL: RES, 0, 5%, 0.063 W, 0402; Manufacturer: Yageo America; CompType: Resistor; Value: 0; Value_Code: 0000; Tolerance_%: 5; Power_W: 0.063; Value2: 0.063W; VDC_V: 50; TempCo: 200 ppm/C; SizeArea_mm2: 0.5; SizeX_mm: 1; SizeZ_mm: 0.6; EIA_Code: E24; U/M: EA; AEC Category: Q200; Green_Lifecycle: Active; Green_REACh: Passed; SymbolVersion: 2009-05-29; PartNumber: RC0402JR-070RL; PackageReference: 0402; RoHS: Y; Res_ohm: 0; Value1: 5%; MountType: SMT; Technology: Thick Film; SizeY_mm: 0.5; Published: 2008-06-26; Publisher: Texas Instruments; LatestRevisionDate: 2017-06-12; ComponentLink1Description: Datasheet link; ComponentLink1URL: http://www.yageo.com/pdf/Pu-RC0402_51_PbFree_L_2.pdf; Supplier 1: Digi-Key; Supplier Part Number 1: 311-0.0JRCT-ND; Supplier 2: Mouser; Supplier Part Number 2: 603-RC0402JR-070RL; Supplier 3: Farnell; Supplier Part Number 3: 9232516; AEC Qualified: ?; Green_EU RoHS: Passed with Exemption; Green_EU RoHS-2: Passed
R25 R27-R30 R32 R34 R35 R53-R55 = ERJ-2RKF1000X: RES, 100, 1%, 0.1 W, 0402; Manufacturer: Panasonic; CompType: Resistor; Res_ohm: 100; Value: 100; Value_Code: 100R; Tolerance_%: 1; Power_W: 0.1; Value2: 0.1W; VDC_V: 50; TempCo: 100 ppm/C; EIA_Code: E96; U/M: EA; AEC Category: Q200; SymbolVersion: 2009-05-29; PartNumber: ERJ-2RKF1000X; PackageReference: 0402; RoHS: Y; Value1: 1%; MountType: SMT; Technology: Thick Film; Published: 2008-06-26; Publisher: Texas Instruments; LatestRevisionDate: 2016-01-08; ComponentLink1Description: Datasheet link; ComponentLink1URL: http://industrial.panasonic.com/www-data/pdf/AOA0000/AOA0000CE2.pdf; Supplier 1: Digi-Key; Supplier Part Number 1: P100LCT-ND; Supplier 2: Mouser; Supplier Part Number 2: 667-ERJ-2RKF1000X; Supplier 3: Farnell; Supplier Part Number 3: 2304034; AEC Qualified: ?
R31 = CRCW0402150KFKED: RES, 150 k, 1%, 0.063 W, 0402; Manufacturer: Vishay-Dale; CompType: Resistor; Value: 150k; Res_ohm: 150000; Tolerance_%: 1; Power_W: 0.063; Value2: 0.063W; VDC_V: 50; TempCo: 100 ppm/C; SizeArea_mm2: 0.5; SizeZ_mm: 0.6; EIA_Code: E96; U/M: EA; AEC Category: Q200; SymbolVersion: 2009-05-29; PartNumber: CRCW0402150KFKED; PackageReference: 0402; RoHS: Y; Value_Code: 150k; Value1: 1%; MountType: SMT; Technology: Thick Film; SizeX_mm: 1; SizeY_mm: 0.5; Published: 2008-06-26; Publisher: Texas Instruments; LatestRevisionDate: 2016-08-08; ComponentLink1Description: Datasheet link; ComponentLink1URL: http://www.vishay.com/docs/20035/dcrcwe3.pdf; Supplier 1: Digi-Key; Supplier Part Number 1: 541-150KLCT-ND; Supplier 2: Mouser; Supplier Part Number 2: 71-CRCW0402-150K-E3; Supplier 3: Farnell; Supplier Part Number 3: 1652753; AEC Qualified: ?
R33 R36 = CRCW040210K0FKED: RES, 10.0 k, 1%, 0.063 W, 0402; Manufacturer: Vishay-Dale; CompType: Resistor; Res_ohm: 10000; Value: 10.0k; Value_Code: 10k0; Tolerance_%: 1; Power_W: 0.063; Value2: 0.063W; VDC_V: 50; TempCo: 100 ppm/C; EIA_Code: E96; U/M: EA; AEC Category: Q200; SizeArea_mm2: 0.5; SizeZ_mm: 0.6; SymbolVersion: 2009-05-29; PartNumber: CRCW040210K0FKED; PackageReference: 0402; RoHS: Y; Value1: 1%; MountType: SMT; Technology: Thick Film; Published: 2008-06-26; Publisher: Texas Instruments; LatestRevisionDate: 2016-08-08; ComponentLink1Description: Datasheet link; ComponentLink1URL: http://www.vishay.com/docs/20035/dcrcwe3.pdf; Supplier 1: Digi-Key; Supplier Part Number 1: 541-10.0KLCT-ND; Supplier 2: Mouser; Supplier Part Number 2: 71-CRCW0402-10K-E3; Supplier 3: Farnell; Supplier Part Number 3: 1469669; AEC Qualified: ?; SizeX_mm: 1; SizeY_mm: 0.5
U8 = DRV8323RSRGZR: 60-V Three-Phase Smart Gate Driver, RGZ0048B; Alternate PartNumber: DRV8323RSRGZT; Manufacturer: Texas Instruments; SymbolCreator: Altium; SizeArea_mm2: 49; SizeAreaWB_mm2: 81; SizeX_mm: 7; SizeZ_mm: 1; CompType: IC; U/M: EA; SymbolVersion: 2016-03-15; PartNumber: DRV8323RSRGZR; PackageReference: RGZ0048B; PackageDescription: VQFN-48; MountType: SMT; SizeY_mm: 7; ComponentLink1Description: Datasheet Link; ComponentLink1URL: https://sps06.itg.ti.com/sites/KMS/crossdivteams/altium/docs/ComponentDatasheets/DRV832x_031016.pdf; RoHS: Y; Publisher: Texas Instruments; LatestRevisionDate: 2016-08-27; Alternate Manufacturer: Texas Instruments